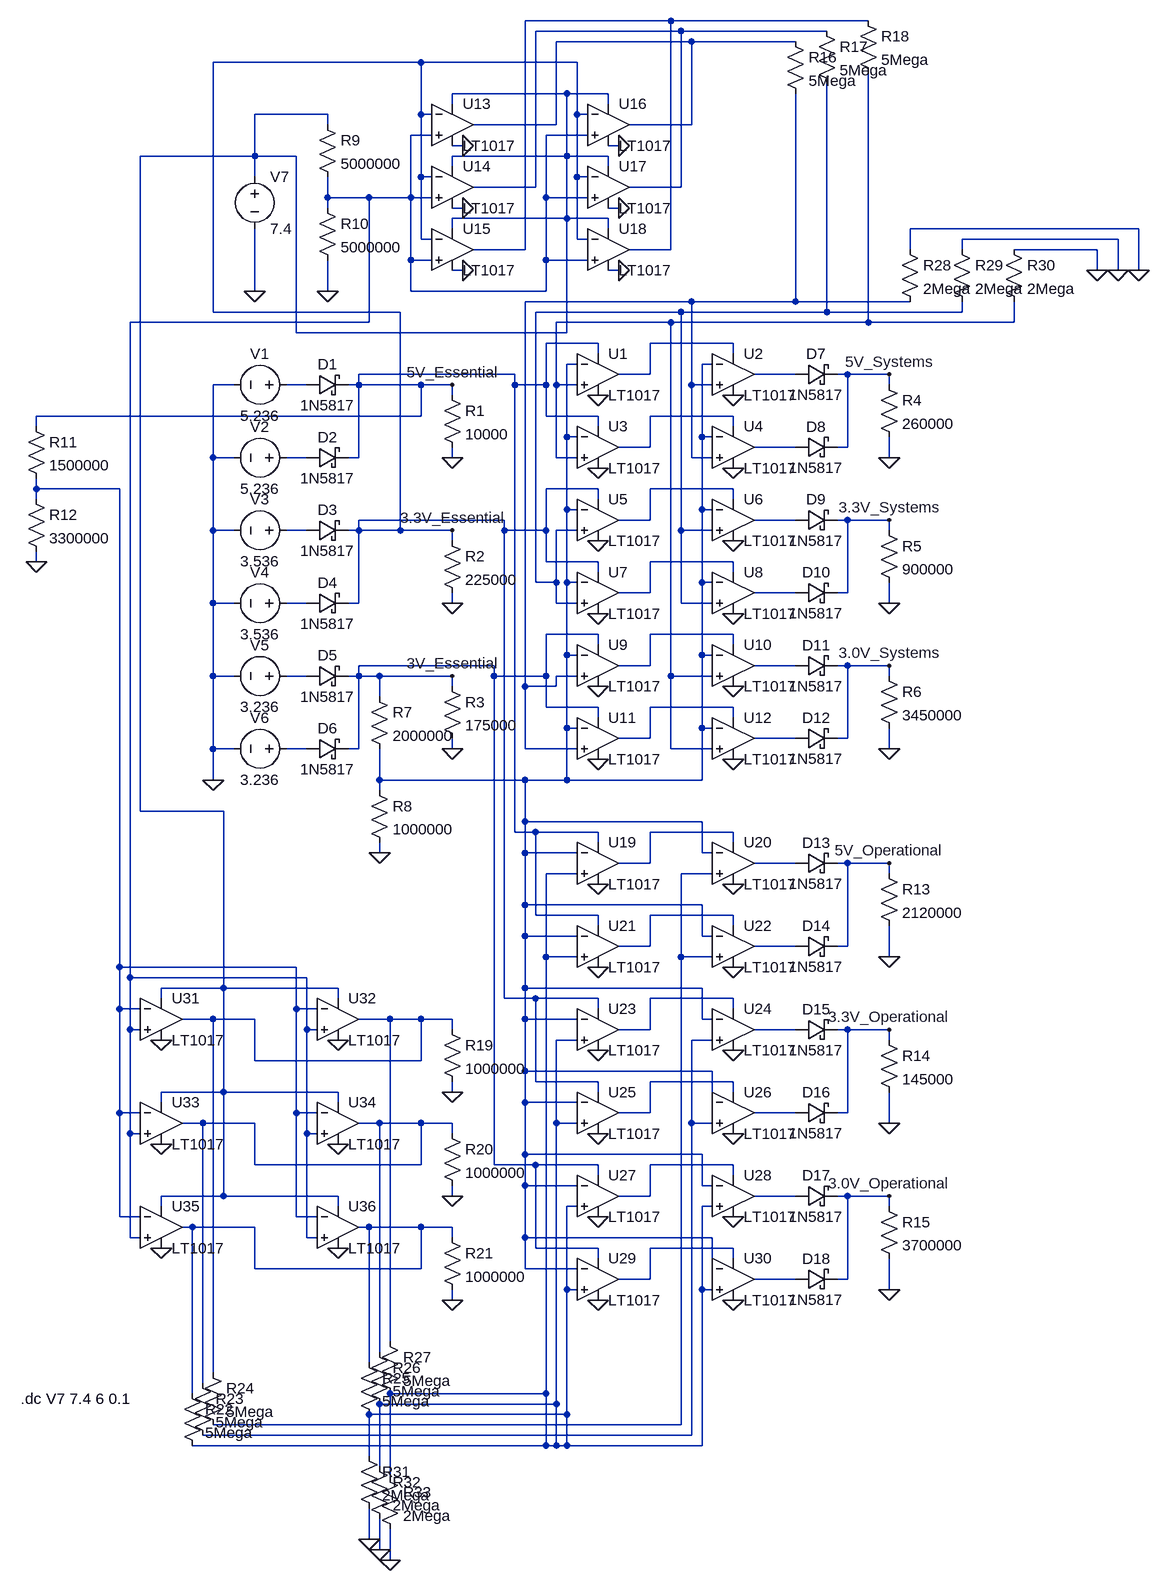
[diagram p0: schematic Cube_Sat_Power_Management.asc]
Cube_Sat_Power_Management.asc, the LTspice schematic file:
Version 4
SHEET 1 2600 2020
WIRE 640 -448 416 -448
WIRE 944 -448 640 -448
WIRE 656 -432 432 -432
WIRE 880 -432 656 -432
WIRE 672 -416 464 -416
WIRE 832 -416 672 -416
WIRE 256 -384 -64 -384
WIRE 496 -384 256 -384
WIRE 480 -336 304 -336
WIRE 544 -336 480 -336
WIRE 304 -320 304 -336
WIRE 544 -320 544 -336
WIRE 112 -304 0 -304
WIRE 256 -304 256 -384
WIRE 272 -304 256 -304
WIRE 496 -304 496 -384
WIRE 512 -304 496 -304
WIRE 112 -288 112 -304
WIRE 464 -288 464 -416
WIRE 464 -288 336 -288
WIRE 672 -288 672 -416
WIRE 672 -288 576 -288
WIRE 272 -272 240 -272
WIRE 512 -272 448 -272
WIRE 320 -256 304 -256
WIRE 560 -256 544 -256
WIRE 0 -240 0 -304
WIRE 0 -240 -176 -240
WIRE 64 -240 0 -240
WIRE 480 -240 480 -336
WIRE 480 -240 304 -240
WIRE 544 -240 480 -240
WIRE 304 -224 304 -240
WIRE 544 -224 544 -240
WIRE 0 -208 0 -240
WIRE 256 -208 256 -304
WIRE 272 -208 256 -208
WIRE 496 -208 496 -304
WIRE 512 -208 496 -208
WIRE 432 -192 432 -432
WIRE 432 -192 336 -192
WIRE 656 -192 656 -432
WIRE 656 -192 576 -192
WIRE 112 -176 112 -208
WIRE 176 -176 112 -176
WIRE 240 -176 240 -272
WIRE 240 -176 176 -176
WIRE 272 -176 240 -176
WIRE 448 -176 448 -272
WIRE 512 -176 448 -176
WIRE 112 -160 112 -176
WIRE 320 -160 304 -160
WIRE 560 -160 544 -160
WIRE 480 -144 480 -240
WIRE 480 -144 304 -144
WIRE 544 -144 480 -144
WIRE 304 -128 304 -144
WIRE 544 -128 544 -144
WIRE 1360 -128 1008 -128
WIRE 256 -112 256 -208
WIRE 272 -112 256 -112
WIRE 496 -112 496 -208
WIRE 512 -112 496 -112
WIRE 1328 -112 1088 -112
WIRE 416 -96 416 -448
WIRE 416 -96 336 -96
WIRE 640 -96 640 -448
WIRE 640 -96 576 -96
WIRE 1008 -96 1008 -128
WIRE 1088 -96 1088 -112
WIRE 1296 -96 1168 -96
WIRE 240 -80 240 -176
WIRE 272 -80 240 -80
WIRE 448 -80 448 -176
WIRE 512 -80 448 -80
WIRE 320 -64 304 -64
WIRE 560 -64 544 -64
WIRE 1296 -64 1296 -96
WIRE 1328 -64 1328 -112
WIRE 1360 -64 1360 -128
WIRE 0 -32 0 -128
WIRE 112 -32 112 -80
WIRE 240 -32 240 -80
WIRE 448 -32 448 -80
WIRE 448 -32 240 -32
WIRE 672 -16 416 -16
WIRE 832 -16 832 -336
WIRE 832 -16 672 -16
WIRE 1008 -16 832 -16
WIRE -64 0 -64 -384
WIRE 224 0 -64 0
WIRE 656 0 432 0
WIRE 880 0 880 -352
WIRE 880 0 656 0
WIRE 1088 0 1088 -16
WIRE 1088 0 880 0
WIRE 176 16 176 -176
WIRE 176 16 -192 16
WIRE 640 16 464 16
WIRE 944 16 944 -368
WIRE 944 16 640 16
WIRE 1168 16 1168 -16
WIRE 1168 16 944 16
WIRE 64 32 64 -240
WIRE 480 32 480 -144
WIRE 480 32 64 32
WIRE 528 48 448 48
WIRE 736 48 608 48
WIRE 528 64 528 48
WIRE 736 64 736 48
WIRE 496 80 480 80
WIRE 704 80 688 80
WIRE 400 96 160 96
WIRE 608 96 608 48
WIRE 608 96 560 96
WIRE 832 96 768 96
WIRE 912 96 896 96
WIRE 976 96 912 96
WIRE -32 112 -64 112
WIRE 80 112 48 112
WIRE 160 112 160 96
WIRE 160 112 144 112
WIRE 256 112 160 112
WIRE 304 112 256 112
WIRE 400 112 400 96
WIRE 448 112 448 48
WIRE 448 112 400 112
WIRE 464 112 464 16
WIRE 496 112 464 112
WIRE 672 112 672 -16
WIRE 704 112 672 112
WIRE 976 112 976 96
WIRE 304 128 304 112
WIRE 256 160 256 112
WIRE 256 160 -336 160
WIRE 448 160 448 112
WIRE 528 160 448 160
WIRE 736 160 608 160
WIRE -336 176 -336 160
WIRE 528 176 528 160
WIRE 736 176 736 160
WIRE 480 192 480 80
WIRE 496 192 480 192
WIRE 688 192 688 80
WIRE 704 192 688 192
WIRE 608 208 608 160
WIRE 608 208 560 208
WIRE 832 208 768 208
WIRE 912 208 912 96
WIRE 912 208 896 208
WIRE -64 224 -64 112
WIRE -32 224 -64 224
WIRE 80 224 48 224
WIRE 160 224 160 112
WIRE 160 224 144 224
WIRE 304 224 304 208
WIRE 464 224 464 112
WIRE 496 224 464 224
WIRE 672 224 672 112
WIRE 704 224 672 224
WIRE 976 224 976 192
WIRE -336 272 -336 256
WIRE -208 272 -336 272
WIRE 528 272 448 272
WIRE 736 272 608 272
WIRE -336 288 -336 272
WIRE 528 288 528 272
WIRE 736 288 736 272
WIRE 480 304 480 192
WIRE 496 304 480 304
WIRE 688 304 688 192
WIRE 704 304 688 304
WIRE 384 320 160 320
WIRE 608 320 608 272
WIRE 608 320 560 320
WIRE 832 320 768 320
WIRE 912 320 896 320
WIRE 976 320 912 320
WIRE -64 336 -64 224
WIRE -32 336 -64 336
WIRE 80 336 48 336
WIRE 160 336 160 320
WIRE 160 336 144 336
WIRE 224 336 224 0
WIRE 224 336 160 336
WIRE 304 336 224 336
WIRE 384 336 384 320
WIRE 448 336 448 272
WIRE 448 336 384 336
WIRE 496 336 464 336
WIRE 656 336 656 0
WIRE 704 336 656 336
WIRE 976 336 976 320
WIRE 304 352 304 336
WIRE -336 384 -336 368
WIRE 448 384 448 336
WIRE 528 384 448 384
WIRE 736 384 608 384
WIRE 528 400 528 384
WIRE 736 400 736 384
WIRE 432 416 432 0
WIRE 464 416 464 336
WIRE 464 416 432 416
WIRE 480 416 480 304
WIRE 496 416 480 416
WIRE 688 416 688 304
WIRE 704 416 688 416
WIRE 608 432 608 384
WIRE 608 432 560 432
WIRE 832 432 768 432
WIRE 912 432 912 320
WIRE 912 432 896 432
WIRE -64 448 -64 336
WIRE -32 448 -64 448
WIRE 80 448 48 448
WIRE 160 448 160 336
WIRE 160 448 144 448
WIRE 304 448 304 432
WIRE 464 448 464 416
WIRE 496 448 464 448
WIRE 656 448 656 336
WIRE 704 448 656 448
WIRE 976 448 976 416
WIRE 528 496 448 496
WIRE 736 496 608 496
WIRE 528 512 528 496
WIRE 736 512 736 496
WIRE 480 528 480 416
WIRE 496 528 480 528
WIRE 688 528 688 416
WIRE 704 528 688 528
WIRE 368 544 160 544
WIRE 608 544 608 496
WIRE 608 544 560 544
WIRE 832 544 768 544
WIRE 912 544 896 544
WIRE 976 544 912 544
WIRE -64 560 -64 448
WIRE -32 560 -64 560
WIRE 80 560 48 560
WIRE 160 560 160 544
WIRE 160 560 144 560
WIRE 192 560 160 560
WIRE 304 560 192 560
WIRE 368 560 368 544
WIRE 448 560 448 496
WIRE 448 560 368 560
WIRE 496 560 464 560
WIRE 640 560 640 16
WIRE 704 560 640 560
WIRE 976 560 976 544
WIRE 304 576 304 560
WIRE 416 576 416 -16
WIRE 464 576 464 560
WIRE 464 576 416 576
WIRE 192 592 192 560
WIRE 448 608 448 560
WIRE 528 608 448 608
WIRE 736 608 608 608
WIRE 528 624 528 608
WIRE 736 624 736 608
WIRE 480 640 480 528
WIRE 496 640 480 640
WIRE 688 640 688 528
WIRE 704 640 688 640
WIRE 608 656 608 608
WIRE 608 656 560 656
WIRE 832 656 768 656
WIRE 912 656 912 544
WIRE 912 656 896 656
WIRE -64 672 -64 560
WIRE -32 672 -64 672
WIRE 80 672 48 672
WIRE 160 672 160 560
WIRE 160 672 144 672
WIRE 304 672 304 656
WIRE 416 672 416 576
WIRE 496 672 416 672
WIRE 640 672 640 560
WIRE 704 672 640 672
WIRE 976 672 976 640
WIRE -64 720 -64 672
WIRE 192 720 192 672
WIRE 416 720 192 720
WIRE 480 720 480 640
WIRE 480 720 416 720
WIRE 688 720 688 640
WIRE 688 720 480 720
WIRE 192 736 192 720
WIRE -176 768 -176 -240
WIRE -48 768 -176 768
WIRE 416 784 416 720
WIRE 688 784 416 784
WIRE 400 800 400 112
WIRE 432 800 400 800
WIRE 528 800 432 800
WIRE 736 800 608 800
WIRE 528 816 528 800
WIRE 736 816 736 800
WIRE 192 832 192 816
WIRE 416 832 416 784
WIRE 496 832 416 832
WIRE 688 832 688 784
WIRE 704 832 688 832
WIRE 608 848 608 800
WIRE 608 848 560 848
WIRE 832 848 768 848
WIRE 912 848 896 848
WIRE 976 848 912 848
WIRE 496 864 448 864
WIRE 704 864 656 864
WIRE 976 864 976 848
WIRE 416 912 416 832
WIRE 688 912 416 912
WIRE 432 928 432 800
WIRE 528 928 432 928
WIRE 736 928 608 928
WIRE 528 944 528 928
WIRE 736 944 736 928
WIRE 416 960 416 912
WIRE 496 960 416 960
WIRE 688 960 688 912
WIRE 704 960 688 960
WIRE 608 976 608 928
WIRE 608 976 560 976
WIRE 832 976 768 976
WIRE 912 976 912 848
WIRE 912 976 896 976
WIRE 448 992 448 864
WIRE 496 992 448 992
WIRE 656 992 656 864
WIRE 704 992 656 992
WIRE 976 992 976 944
WIRE -208 1008 -208 272
WIRE 64 1008 -208 1008
WIRE -192 1024 -192 16
WIRE 80 1024 -192 1024
WIRE -48 1040 -48 768
WIRE -48 1040 -144 1040
WIRE 128 1040 -48 1040
WIRE 416 1040 416 960
WIRE 688 1040 416 1040
WIRE -144 1056 -144 1040
WIRE 128 1056 128 1040
WIRE 384 1056 384 336
WIRE 432 1056 384 1056
WIRE 528 1056 432 1056
WIRE 736 1056 608 1056
WIRE -208 1072 -208 1008
WIRE -176 1072 -208 1072
WIRE 64 1072 64 1008
WIRE 96 1072 64 1072
WIRE 528 1072 528 1056
WIRE 736 1072 736 1056
WIRE -64 1088 -112 1088
WIRE 0 1088 -64 1088
WIRE 208 1088 160 1088
WIRE 256 1088 208 1088
WIRE 304 1088 256 1088
WIRE 416 1088 416 1040
WIRE 496 1088 416 1088
WIRE 688 1088 688 1040
WIRE 704 1088 688 1088
WIRE -192 1104 -192 1024
WIRE -176 1104 -192 1104
WIRE 80 1104 80 1024
WIRE 96 1104 80 1104
WIRE 304 1104 304 1088
WIRE 608 1104 608 1056
WIRE 608 1104 560 1104
WIRE 832 1104 768 1104
WIRE 912 1104 896 1104
WIRE 976 1104 912 1104
WIRE 496 1120 464 1120
WIRE 704 1120 672 1120
WIRE 976 1120 976 1104
WIRE 0 1152 0 1088
WIRE 256 1152 256 1088
WIRE 256 1152 0 1152
WIRE 416 1168 416 1088
WIRE 704 1168 416 1168
WIRE 432 1184 432 1056
WIRE 528 1184 432 1184
WIRE 736 1184 608 1184
WIRE -48 1200 -48 1040
WIRE -48 1200 -144 1200
WIRE 128 1200 -48 1200
WIRE 304 1200 304 1184
WIRE 528 1200 528 1184
WIRE 736 1200 736 1184
WIRE -144 1216 -144 1200
WIRE 128 1216 128 1200
WIRE 416 1216 416 1168
WIRE 496 1216 416 1216
WIRE 704 1216 704 1168
WIRE -208 1232 -208 1072
WIRE -176 1232 -208 1232
WIRE 64 1232 64 1072
WIRE 96 1232 64 1232
WIRE 608 1232 608 1184
WIRE 608 1232 560 1232
WIRE 832 1232 768 1232
WIRE 912 1232 912 1104
WIRE 912 1232 896 1232
WIRE -80 1248 -112 1248
WIRE 0 1248 -80 1248
WIRE 192 1248 160 1248
WIRE 256 1248 192 1248
WIRE 304 1248 256 1248
WIRE 464 1248 464 1120
WIRE 496 1248 464 1248
WIRE 672 1248 672 1120
WIRE 704 1248 672 1248
WIRE 976 1248 976 1200
WIRE -192 1264 -192 1104
WIRE -176 1264 -192 1264
WIRE 80 1264 80 1104
WIRE 96 1264 80 1264
WIRE 304 1264 304 1248
WIRE 416 1296 416 1216
WIRE 688 1296 416 1296
WIRE 0 1312 0 1248
WIRE 256 1312 256 1248
WIRE 256 1312 0 1312
WIRE 368 1312 368 560
WIRE 432 1312 368 1312
WIRE 528 1312 432 1312
WIRE 736 1312 608 1312
WIRE 528 1328 528 1312
WIRE 736 1328 736 1312
WIRE 416 1344 416 1296
WIRE 496 1344 416 1344
WIRE 688 1344 688 1296
WIRE 704 1344 688 1344
WIRE -48 1360 -48 1200
WIRE -48 1360 -144 1360
WIRE 128 1360 -48 1360
WIRE 304 1360 304 1344
WIRE 608 1360 608 1312
WIRE 608 1360 560 1360
WIRE 832 1360 768 1360
WIRE 912 1360 896 1360
WIRE 976 1360 912 1360
WIRE -144 1376 -144 1360
WIRE 128 1376 128 1360
WIRE 496 1376 480 1376
WIRE 704 1376 688 1376
WIRE 976 1376 976 1360
WIRE -208 1392 -208 1232
WIRE -176 1392 -208 1392
WIRE 64 1392 64 1232
WIRE 96 1392 64 1392
WIRE -96 1408 -112 1408
WIRE 0 1408 -96 1408
WIRE 176 1408 160 1408
WIRE 256 1408 176 1408
WIRE 304 1408 256 1408
WIRE -192 1424 -192 1264
WIRE -176 1424 -192 1424
WIRE 80 1424 80 1264
WIRE 96 1424 80 1424
WIRE 304 1424 304 1408
WIRE 416 1424 416 1344
WIRE 704 1424 416 1424
WIRE 432 1440 432 1312
WIRE 528 1440 432 1440
WIRE 736 1440 608 1440
WIRE 528 1456 528 1440
WIRE 736 1456 736 1440
WIRE 0 1472 0 1408
WIRE 256 1472 256 1408
WIRE 256 1472 0 1472
WIRE 416 1472 416 1424
WIRE 496 1472 416 1472
WIRE 704 1472 704 1424
WIRE 608 1488 608 1440
WIRE 608 1488 560 1488
WIRE 832 1488 768 1488
WIRE 912 1488 912 1360
WIRE 912 1488 896 1488
WIRE 480 1504 480 1376
WIRE 496 1504 480 1504
WIRE 688 1504 688 1376
WIRE 704 1504 688 1504
WIRE 976 1504 976 1456
WIRE 304 1520 304 1504
WIRE 208 1584 208 1088
WIRE 192 1600 192 1248
WIRE 176 1616 176 1408
WIRE -64 1632 -64 1088
WIRE -80 1648 -80 1248
WIRE -96 1664 -96 1408
WIRE 448 1664 448 992
WIRE 448 1664 208 1664
WIRE 464 1680 464 1248
WIRE 464 1680 192 1680
WIRE 480 1696 480 1504
WIRE 480 1696 176 1696
WIRE 656 1712 656 992
WIRE 656 1712 -64 1712
WIRE 672 1728 672 1248
WIRE 672 1728 -80 1728
WIRE 448 1744 448 1664
WIRE 448 1744 -96 1744
WIRE 464 1744 464 1680
WIRE 464 1744 448 1744
WIRE 480 1744 480 1696
WIRE 480 1744 464 1744
WIRE 688 1744 688 1504
WIRE 688 1744 480 1744
WIRE 176 1760 176 1696
WIRE 192 1776 192 1680
WIRE 208 1792 208 1664
WIRE 176 1888 176 1840
WIRE 192 1904 192 1856
WIRE 208 1920 208 1872
FLAG -64 720 0
FLAG 304 224 0
FLAG 304 448 0
FLAG 304 672 0
FLAG 304 112 5V_Essential
FLAG 304 336 3.3V_Essential
FLAG 304 560 3V_Essential
FLAG 528 128 0
FLAG 736 128 0
FLAG 736 240 0
FLAG 528 240 0
FLAG 528 352 0
FLAG 736 352 0
FLAG 736 464 0
FLAG 528 464 0
FLAG 528 576 0
FLAG 736 576 0
FLAG 736 688 0
FLAG 976 672 0
FLAG 976 448 0
FLAG 976 224 0
FLAG 976 96 5V_Systems
FLAG 976 320 3.3V_Systems
FLAG 976 544 3.0V_Systems
FLAG 192 832 0
FLAG 528 880 0
FLAG 736 880 0
FLAG 736 1008 0
FLAG 528 1008 0
FLAG 528 1136 0
FLAG 736 1136 0
FLAG 736 1264 0
FLAG 528 1264 0
FLAG 528 1520 0
FLAG 736 1520 0
FLAG 736 1392 0
FLAG 528 1392 0
FLAG -144 1120 0
FLAG 128 1120 0
FLAG 128 1280 0
FLAG -144 1280 0
FLAG -144 1440 0
FLAG 128 1440 0
FLAG 320 -256 0
FLAG 320 -160 0
FLAG 320 -64 0
FLAG 560 -64 0
FLAG 560 -160 0
FLAG 560 -256 0
FLAG 112 -32 0
FLAG 0 -32 0
FLAG -336 384 0
FLAG 976 992 0
FLAG 976 1248 0
FLAG 976 1504 0
FLAG 976 848 5V_Operational
FLAG 976 1104 3.3V_Operational
FLAG 976 1360 3.0V_Operational
FLAG 304 1200 0
FLAG 304 1360 0
FLAG 304 1520 0
FLAG 528 688 0
FLAG 176 1888 0
FLAG 192 1904 0
FLAG 208 1920 0
FLAG 1296 -64 0
FLAG 1328 -64 0
FLAG 1360 -64 0
SYMBOL voltage 64 112 R90
WINDOW 0 -32 56 VBottom 2
WINDOW 3 32 56 VTop 2
WINDOW 123 0 0 Left 0
WINDOW 39 0 0 Left 0
SYMATTR InstName V1
SYMATTR Value 5.236
SYMBOL voltage 64 224 R90
WINDOW 0 -32 56 VBottom 2
WINDOW 3 32 56 VTop 2
WINDOW 123 0 0 Left 0
WINDOW 39 0 0 Left 0
SYMATTR InstName V2
SYMATTR Value 5.236
SYMBOL voltage 64 336 R90
WINDOW 0 -32 56 VBottom 2
WINDOW 3 32 56 VTop 2
WINDOW 123 0 0 Left 0
WINDOW 39 0 0 Left 0
SYMATTR InstName V3
SYMATTR Value 3.536
SYMBOL voltage 64 448 R90
WINDOW 0 -32 56 VBottom 2
WINDOW 3 32 56 VTop 2
WINDOW 123 0 0 Left 0
WINDOW 39 0 0 Left 0
SYMATTR InstName V4
SYMATTR Value 3.536
SYMBOL voltage 64 560 R90
WINDOW 0 -32 56 VBottom 2
WINDOW 3 32 56 VTop 2
WINDOW 123 0 0 Left 0
WINDOW 39 0 0 Left 0
SYMATTR InstName V5
SYMATTR Value 3.236
SYMBOL voltage 64 672 R90
WINDOW 0 -32 56 VBottom 2
WINDOW 3 32 56 VTop 2
WINDOW 123 0 0 Left 0
WINDOW 39 0 0 Left 0
SYMATTR InstName V6
SYMATTR Value 3.236
SYMBOL res 288 112 R0
SYMATTR InstName R1
SYMATTR Value 10000
SYMBOL res 288 336 R0
SYMATTR InstName R2
SYMATTR Value 225000
SYMBOL res 288 560 R0
SYMATTR InstName R3
SYMATTR Value 175000
SYMBOL Comparators\\LT1017 528 96 R0
SYMATTR InstName U1
SYMBOL Comparators\\LT1017 736 96 R0
SYMATTR InstName U2
SYMBOL Comparators\\LT1017 528 208 R0
SYMATTR InstName U3
SYMBOL Comparators\\LT1017 736 208 R0
SYMATTR InstName U4
SYMBOL Comparators\\LT1017 528 320 R0
SYMATTR InstName U5
SYMBOL Comparators\\LT1017 736 320 R0
SYMATTR InstName U6
SYMBOL Comparators\\LT1017 528 432 R0
SYMATTR InstName U7
SYMBOL Comparators\\LT1017 736 432 R0
SYMATTR InstName U8
SYMBOL Comparators\\LT1017 528 544 R0
SYMATTR InstName U9
SYMBOL Comparators\\LT1017 736 544 R0
SYMATTR InstName U10
SYMBOL Comparators\\LT1017 528 656 R0
SYMATTR InstName U11
SYMBOL Comparators\\LT1017 736 656 R0
SYMATTR InstName U12
SYMBOL Comparators\\LT1017 304 -288 R0
SYMATTR InstName U13
SYMBOL Comparators\\LT1017 304 -192 R0
SYMATTR InstName U14
SYMBOL Comparators\\LT1017 304 -96 R0
SYMATTR InstName U15
SYMBOL Comparators\\LT1017 544 -288 R0
SYMATTR InstName U16
SYMBOL Comparators\\LT1017 544 -192 R0
SYMATTR InstName U17
SYMBOL Comparators\\LT1017 544 -96 R0
SYMATTR InstName U18
SYMBOL res 960 96 R0
SYMATTR InstName R4
SYMATTR Value 260000
SYMBOL res 960 320 R0
SYMATTR InstName R5
SYMATTR Value 900000
SYMBOL res 960 544 R0
SYMATTR InstName R6
SYMATTR Value 3450000
SYMBOL Comparators\\LT1017 528 848 R0
SYMATTR InstName U19
SYMBOL Comparators\\LT1017 736 848 R0
SYMATTR InstName U20
SYMBOL Comparators\\LT1017 528 976 R0
SYMATTR InstName U21
SYMBOL Comparators\\LT1017 736 976 R0
SYMATTR InstName U22
SYMBOL Comparators\\LT1017 528 1104 R0
SYMATTR InstName U23
SYMBOL Comparators\\LT1017 736 1104 R0
SYMATTR InstName U24
SYMBOL Comparators\\LT1017 528 1232 R0
SYMATTR InstName U25
SYMBOL Comparators\\LT1017 736 1232 R0
SYMATTR InstName U26
SYMBOL Comparators\\LT1017 528 1360 R0
SYMATTR InstName U27
SYMBOL Comparators\\LT1017 736 1360 R0
SYMATTR InstName U28
SYMBOL Comparators\\LT1017 528 1488 R0
SYMATTR InstName U29
SYMBOL Comparators\\LT1017 736 1488 R0
SYMATTR InstName U30
SYMBOL res 176 576 R0
SYMATTR InstName R7
SYMATTR Value 2000000
SYMBOL res 176 720 R0
SYMATTR InstName R8
SYMATTR Value 1000000
SYMBOL Comparators\\LT1017 -144 1088 R0
SYMATTR InstName U31
SYMBOL Comparators\\LT1017 128 1088 R0
SYMATTR InstName U32
SYMBOL Comparators\\LT1017 -144 1248 R0
SYMATTR InstName U33
SYMBOL Comparators\\LT1017 128 1248 R0
SYMATTR InstName U34
SYMBOL Comparators\\LT1017 -144 1408 R0
SYMATTR InstName U35
SYMBOL Comparators\\LT1017 128 1408 R0
SYMATTR InstName U36
SYMBOL voltage 0 -224 R0
WINDOW 123 0 0 Left 0
WINDOW 39 0 0 Left 0
SYMATTR InstName V7
SYMATTR Value 7.4
SYMBOL res 96 -304 R0
SYMATTR InstName R9
SYMATTR Value 5000000
SYMBOL res 96 -176 R0
SYMATTR InstName R10
SYMATTR Value 5000000
SYMBOL res -352 160 R0
SYMATTR InstName R11
SYMATTR Value 1500000
SYMBOL res -352 272 R0
SYMATTR InstName R12
SYMATTR Value 3300000
SYMBOL res 960 848 R0
SYMATTR InstName R13
SYMATTR Value 2120000
SYMBOL res 960 1104 R0
SYMATTR InstName R14
SYMATTR Value 145000
SYMBOL res 960 1360 R0
SYMATTR InstName R15
SYMATTR Value 3700000
SYMBOL schottky 80 128 R270
WINDOW 0 32 32 VTop 2
WINDOW 3 0 32 VBottom 2
SYMATTR InstName D1
SYMATTR Value 1N5817
SYMATTR Description Diode
SYMATTR Type diode
SYMBOL schottky 80 240 R270
WINDOW 0 32 32 VTop 2
WINDOW 3 0 32 VBottom 2
SYMATTR InstName D2
SYMATTR Value 1N5817
SYMATTR Description Diode
SYMATTR Type diode
SYMBOL schottky 80 352 R270
WINDOW 0 32 32 VTop 2
WINDOW 3 0 32 VBottom 2
SYMATTR InstName D3
SYMATTR Value 1N5817
SYMATTR Description Diode
SYMATTR Type diode
SYMBOL schottky 80 464 R270
WINDOW 0 32 32 VTop 2
WINDOW 3 0 32 VBottom 2
SYMATTR InstName D4
SYMATTR Value 1N5817
SYMATTR Description Diode
SYMATTR Type diode
SYMBOL schottky 80 576 R270
WINDOW 0 32 32 VTop 2
WINDOW 3 0 32 VBottom 2
SYMATTR InstName D5
SYMATTR Value 1N5817
SYMATTR Description Diode
SYMATTR Type diode
SYMBOL schottky 80 688 R270
WINDOW 0 32 32 VTop 2
WINDOW 3 0 32 VBottom 2
SYMATTR InstName D6
SYMATTR Value 1N5817
SYMATTR Description Diode
SYMATTR Type diode
SYMBOL schottky 832 112 R270
WINDOW 0 32 32 VTop 2
WINDOW 3 0 32 VBottom 2
SYMATTR InstName D7
SYMATTR Value 1N5817
SYMATTR Description Diode
SYMATTR Type diode
SYMBOL schottky 832 224 R270
WINDOW 0 32 32 VTop 2
WINDOW 3 0 32 VBottom 2
SYMATTR InstName D8
SYMATTR Value 1N5817
SYMATTR Description Diode
SYMATTR Type diode
SYMBOL schottky 832 336 R270
WINDOW 0 32 32 VTop 2
WINDOW 3 0 32 VBottom 2
SYMATTR InstName D9
SYMATTR Value 1N5817
SYMATTR Description Diode
SYMATTR Type diode
SYMBOL schottky 832 448 R270
WINDOW 0 32 32 VTop 2
WINDOW 3 0 32 VBottom 2
SYMATTR InstName D10
SYMATTR Value 1N5817
SYMATTR Description Diode
SYMATTR Type diode
SYMBOL schottky 832 560 R270
WINDOW 0 32 32 VTop 2
WINDOW 3 0 32 VBottom 2
SYMATTR InstName D11
SYMATTR Value 1N5817
SYMATTR Description Diode
SYMATTR Type diode
SYMBOL schottky 832 672 R270
WINDOW 0 32 32 VTop 2
WINDOW 3 0 32 VBottom 2
SYMATTR InstName D12
SYMATTR Value 1N5817
SYMATTR Description Diode
SYMATTR Type diode
SYMBOL schottky 832 864 R270
WINDOW 0 32 32 VTop 2
WINDOW 3 0 32 VBottom 2
SYMATTR InstName D13
SYMATTR Value 1N5817
SYMATTR Description Diode
SYMATTR Type diode
SYMBOL schottky 832 992 R270
WINDOW 0 32 32 VTop 2
WINDOW 3 0 32 VBottom 2
SYMATTR InstName D14
SYMATTR Value 1N5817
SYMATTR Description Diode
SYMATTR Type diode
SYMBOL schottky 832 1120 R270
WINDOW 0 32 32 VTop 2
WINDOW 3 0 32 VBottom 2
SYMATTR InstName D15
SYMATTR Value 1N5817
SYMATTR Description Diode
SYMATTR Type diode
SYMBOL schottky 832 1248 R270
WINDOW 0 32 32 VTop 2
WINDOW 3 0 32 VBottom 2
SYMATTR InstName D16
SYMATTR Value 1N5817
SYMATTR Description Diode
SYMATTR Type diode
SYMBOL schottky 832 1376 R270
WINDOW 0 32 32 VTop 2
WINDOW 3 0 32 VBottom 2
SYMATTR InstName D17
SYMATTR Value 1N5817
SYMATTR Description Diode
SYMATTR Type diode
SYMBOL schottky 832 1504 R270
WINDOW 0 32 32 VTop 2
WINDOW 3 0 32 VBottom 2
SYMATTR InstName D18
SYMATTR Value 1N5817
SYMATTR Description Diode
SYMATTR Type diode
SYMBOL res 288 1088 R0
SYMATTR InstName R19
SYMATTR Value 1000000
SYMBOL res 288 1248 R0
SYMATTR InstName R20
SYMATTR Value 1000000
SYMBOL res 288 1408 R0
SYMATTR InstName R21
SYMATTR Value 1000000
SYMBOL res -112 1648 R0
SYMATTR InstName R22
SYMATTR Value 5Mega
SYMBOL res -96 1632 R0
SYMATTR InstName R23
SYMATTR Value 5Mega
SYMBOL res -80 1616 R0
SYMATTR InstName R24
SYMATTR Value 5Mega
SYMBOL res 160 1600 R0
SYMATTR InstName R25
SYMATTR Value 5Mega
SYMBOL res 176 1584 R0
SYMATTR InstName R26
SYMATTR Value 5Mega
SYMBOL res 192 1568 R0
SYMATTR InstName R27
SYMATTR Value 5Mega
SYMBOL res 160 1744 R0
SYMATTR InstName R31
SYMATTR Value 2Mega
SYMBOL res 176 1760 R0
SYMATTR InstName R32
SYMATTR Value 2Mega
SYMBOL res 192 1776 R0
SYMATTR InstName R33
SYMATTR Value 2Mega
SYMBOL res 816 -432 R0
SYMATTR InstName R16
SYMATTR Value 5Mega
SYMBOL res 864 -448 R0
SYMATTR InstName R17
SYMATTR Value 5Mega
SYMBOL res 928 -464 R0
SYMATTR InstName R18
SYMATTR Value 5Mega
SYMBOL res 992 -112 R0
SYMATTR InstName R28
SYMATTR Value 2Mega
SYMBOL res 1072 -112 R0
SYMATTR InstName R29
SYMATTR Value 2Mega
SYMBOL res 1152 -112 R0
SYMATTR InstName R30
SYMATTR Value 2Mega
TEXT -360 1672 Left 2 !.dc V7 7.4 6 0.1

The netlist it stands for:
* Cube_Sat_Power_Management.asc
V1 N012 0 5.236
V2 N015 0 5.236
V3 N019 0 3.536
V4 N022 0 3.536
V5 N025 0 3.236
V6 N028 0 3.236
R1 5V_Essential 0 10000
R2 3.3V_Essential 0 225000
R3 3V_Essential 0 175000
XU1 N008 N010 5V_Essential 0 N009 LT1017  ; pins In+ In- V+ V- OUT
XU2 N006 N010 N009 0 N011 LT1017  ; pins In+ In- V+ V- OUT
XU3 N008 N010 5V_Essential 0 N013 LT1017  ; pins In+ In- V+ V- OUT
XU4 N006 N010 N013 0 N014 LT1017  ; pins In+ In- V+ V- OUT
XU5 N007 N010 3.3V_Essential 0 N017 LT1017  ; pins In+ In- V+ V- OUT
XU6 N007 N010 N017 0 N018 LT1017  ; pins In+ In- V+ V- OUT
XU7 N007 N010 3.3V_Essential 0 N020 LT1017  ; pins In+ In- V+ V- OUT
XU8 N007 N010 N020 0 N021 LT1017  ; pins In+ In- V+ V- OUT
XU9 N006 N010 3V_Essential 0 N023 LT1017  ; pins In+ In- V+ V- OUT
XU10 N008 N010 N023 0 N024 LT1017  ; pins In+ In- V+ V- OUT
XU11 N006 N010 3V_Essential 0 N026 LT1017  ; pins In+ In- V+ V- OUT
XU12 N008 N010 N026 0 N027 LT1017  ; pins In+ In- V+ V- OUT
XU13 N005 3.3V_Essential N004 0 N003 LT1017  ; pins In+ In- V+ V- OUT
XU14 N005 3.3V_Essential N004 0 N002 LT1017  ; pins In+ In- V+ V- OUT
XU15 N005 3.3V_Essential N004 0 N001 LT1017  ; pins In+ In- V+ V- OUT
XU16 N005 3.3V_Essential N004 0 N003 LT1017  ; pins In+ In- V+ V- OUT
XU17 N005 3.3V_Essential N004 0 N002 LT1017  ; pins In+ In- V+ V- OUT
XU18 N005 3.3V_Essential N004 0 N001 LT1017  ; pins In+ In- V+ V- OUT
R4 5V_Systems 0 260000
R5 3.3V_Systems 0 900000
R6 3.0V_Systems 0 3450000
XU19 N031 N010 5V_Essential 0 N029 LT1017  ; pins In+ In- V+ V- OUT
XU20 N032 N010 N029 0 N030 LT1017  ; pins In+ In- V+ V- OUT
XU21 N031 N010 5V_Essential 0 N033 LT1017  ; pins In+ In- V+ V- OUT
XU22 N032 N010 N033 0 N034 LT1017  ; pins In+ In- V+ V- OUT
XU23 N031 N010 3.3V_Essential 0 N035 LT1017  ; pins In+ In- V+ V- OUT
XU24 N038 N010 N035 0 N037 LT1017  ; pins In+ In- V+ V- OUT
XU25 N031 N010 3.3V_Essential 0 N039 LT1017  ; pins In+ In- V+ V- OUT
XU26 N038 N010 N039 0 N040 LT1017  ; pins In+ In- V+ V- OUT
XU27 N031 N010 3V_Essential 0 N042 LT1017  ; pins In+ In- V+ V- OUT
XU28 N031 N010 N042 0 N043 LT1017  ; pins In+ In- V+ V- OUT
XU29 N031 N010 3V_Essential 0 N045 LT1017  ; pins In+ In- V+ V- OUT
XU30 N031 N010 N045 0 N046 LT1017  ; pins In+ In- V+ V- OUT
R7 3V_Essential N010 2000000
R8 N010 0 1000000
XU31 N005 N016 N004 0 N036 LT1017  ; pins In+ In- V+ V- OUT
XU32 N005 N016 N004 0 N036 LT1017  ; pins In+ In- V+ V- OUT
XU33 N005 N016 N004 0 N041 LT1017  ; pins In+ In- V+ V- OUT
XU34 N005 N016 N004 0 N041 LT1017  ; pins In+ In- V+ V- OUT
XU35 N005 N016 N004 0 N044 LT1017  ; pins In+ In- V+ V- OUT
XU36 N005 N016 N004 0 N044 LT1017  ; pins In+ In- V+ V- OUT
V7 N004 0 7.4
R9 N004 N005 5000000
R10 N005 0 5000000
R11 5V_Essential N016 1500000
R12 N016 0 3300000
R13 5V_Operational 0 2120000
R14 3.3V_Operational 0 145000
R15 3.0V_Operational 0 3700000
D1 N012 5V_Essential 1N5817
D2 N015 5V_Essential 1N5817
D3 N019 3.3V_Essential 1N5817
D4 N022 3.3V_Essential 1N5817
D5 N025 3V_Essential 1N5817
D6 N028 3V_Essential 1N5817
D7 N011 5V_Systems 1N5817
D8 N014 5V_Systems 1N5817
D9 N018 3.3V_Systems 1N5817
D10 N021 3.3V_Systems 1N5817
D11 N024 3.0V_Systems 1N5817
D12 N027 3.0V_Systems 1N5817
D13 N030 5V_Operational 1N5817
D14 N034 5V_Operational 1N5817
D15 N037 3.3V_Operational 1N5817
D16 N040 3.3V_Operational 1N5817
D17 N043 3.0V_Operational 1N5817
D18 N046 3.0V_Operational 1N5817
R19 N036 0 1000000
R20 N041 0 1000000
R21 N044 0 1000000
R22 N044 N031 5Mega
R23 N041 N038 5Mega
R24 N036 N032 5Mega
R25 N044 N031 5Mega
R26 N041 N031 5Mega
R27 N036 N031 5Mega
R31 N031 0 2Mega
R32 N031 0 2Mega
R33 N031 0 2Mega
R16 N003 N006 5Mega
R17 N002 N007 5Mega
R18 N001 N008 5Mega
R28 0 N006 2Mega
R29 0 N007 2Mega
R30 0 N008 2Mega
.model D D
.lib standard.dio
.dc V7 7.4 6 0.1
.backanno
.end